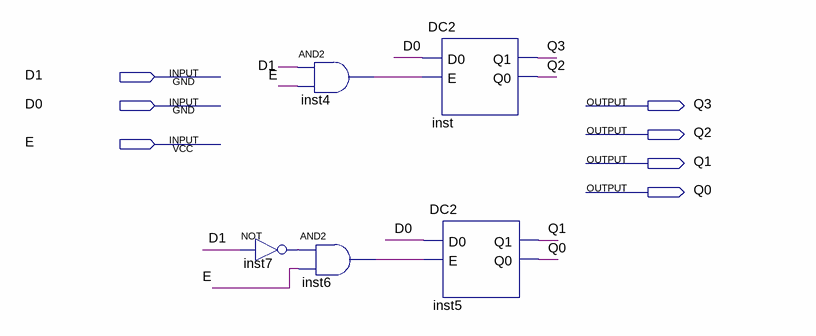
[diagram p0: schematic sheet]
// Quartus schematic DC4.bdf as structural Verilog: 5 symbols, 7 pins
module DC4 (
  input  D1,
  input  D0,
  input  E,
  output Q3,
  output Q2,
  output Q1,
  output Q0
);

  wire inst4_out, inst6_out, inst7_out;

  not inst7 (inst7_out, D1);
  and inst4 (inst4_out, D1, E);
  and inst6 (inst6_out, inst7_out, E);
  DC2 inst (.D0(D0), .E(inst4_out), .Q1(Q3), .Q0(Q2));
  DC2 inst5 (.D0(D0), .E(inst6_out), .Q1(Q1), .Q0(Q0));
endmodule
